# EAGLE design tweeq-BattCharger v1 (EAGLE 6.4)
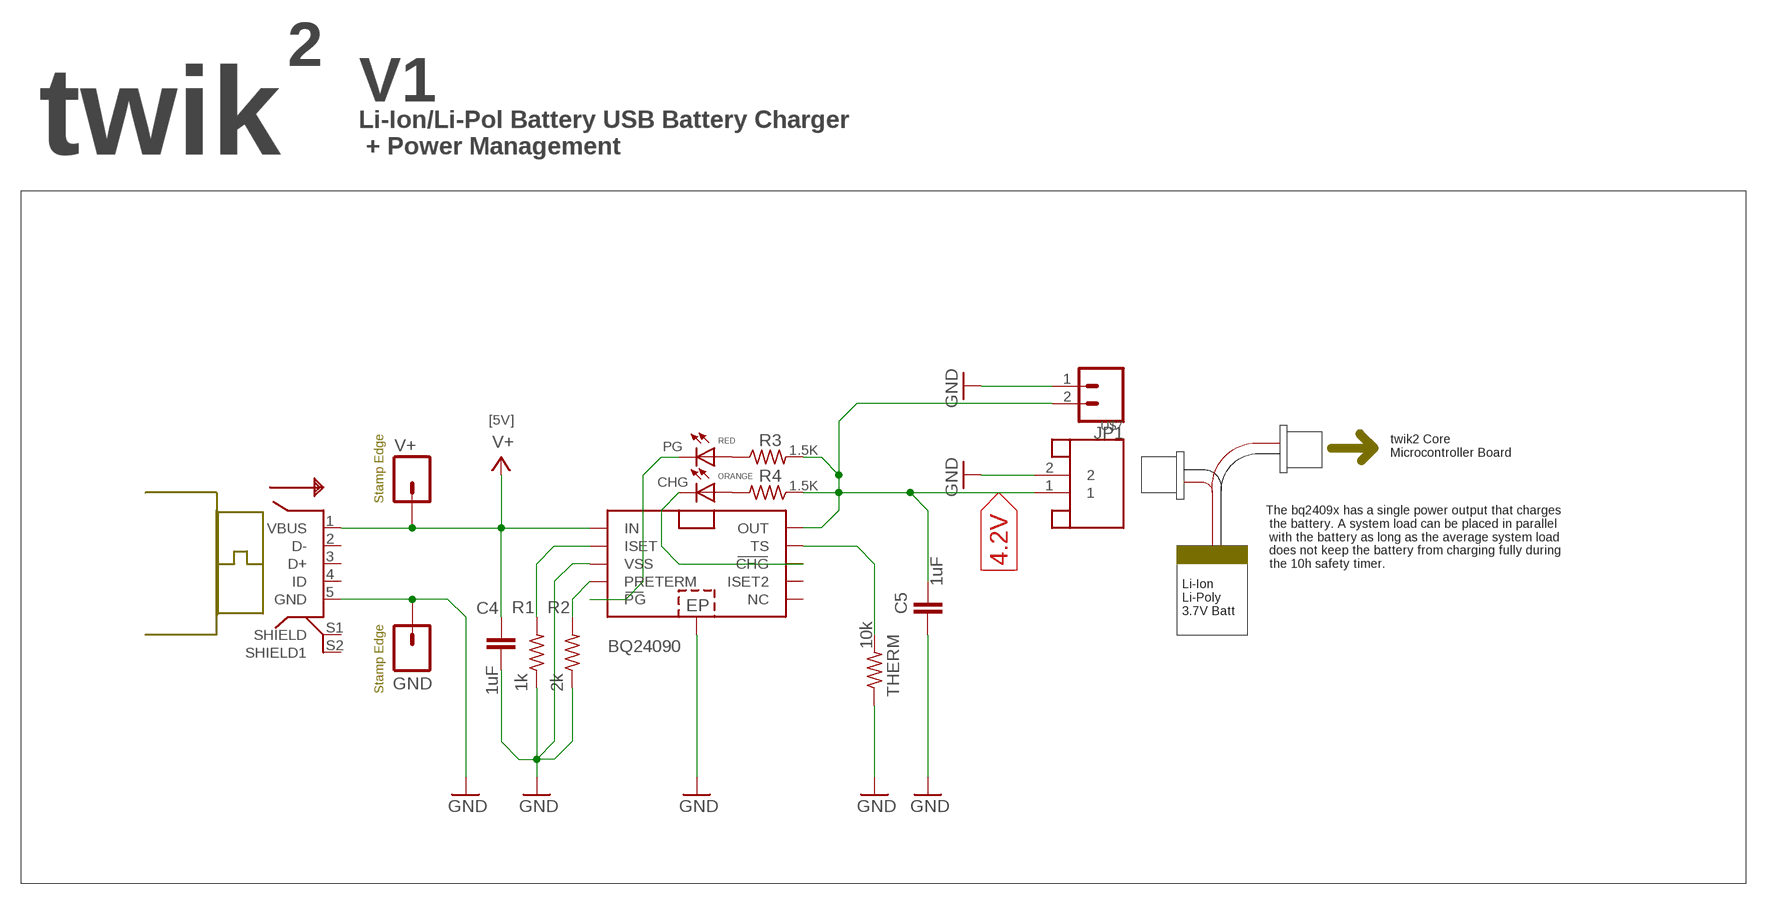
[diagram p0: schematic, sheet 1]

## Parts
BQ24090  BQ2409X-DGQ  [MSOP10_POWERPAD]
C4  1uF  C-EUC0603K  [C0603K]
C5  1uF  C-EUC0603K  [C0603K]
CHG  ORANGE  LEDCHIP-LED0603  [CHIP-LED0603]
GND  M01SQ_NS  [1X01_SQ]
JP1  M022.54-POL-TH  [1X02_2.54POL_TH]
PG  RED  LEDCHIP-LED0603  [CHIP-LED0603]
R1  1k  R-US_R0402  [R0402]
R2  2k  R-US_R0402  [R0402]
R3  1.5K  R-US_R0402  [R0402]
R4  1.5K  R-US_R0402  [R0402]
THERM  10k  R-US_R0402  [R0402]
U$2  USB/MICRO-5PF-B  [MICRO_USB_5PF_B]
U$7  JST-2PINSH  [SH1.0-2PIN]
V+  M01/R_NS  [1X01NS]

## Nets
4.2V: BQ24090.10(OUT) C5.2 JP1.2 R3.2 R4.1 U$7.1
GND: BQ24090.3(VSS) BQ24090.EP C4.2 C5.1 GND.1 JP1.1 R1.1 R2.1 THERM.1 U$2.5(GND) U$7.2
N$1: BQ24090.2(ISET) R1.2
N$2: BQ24090.5(PG) PG.C
N$3: BQ24090.4(PRETERM) R2.2
N$4: PG.A R3.1
N$6: BQ24090.9(TS) THERM.2
N$7: BQ24090.8(CHG) CHG.C
N$8: CHG.A R4.2
V+: BQ24090.1(IN) C4.1 U$2.1(VBUS) V+.1
Unconnected: BQ24090.6(NC) BQ24090.7(ISET2) U$2.2(D-) U$2.3(D+) U$2.4(ID) U$2.S1(SHIELD) U$2.S2(SHIELD1)

## Notes on the sheet
- 2
- V1
- twik
- Li-Ion/Li-Pol Battery USB Battery Charger
   + Power Management
- [5V]
- twik2 Core
  Microcontroller Board
- Stamp Edge
- The bq2409x has a single power output that charges
   the battery. A system load can be placed in parallel
   with the battery as long as the average system load
   does not keep the battery from charging fully during
   the 10h safety timer.
- Li-Ion
  Li-Poly
  3.7V Batt
- Stamp Edge

## Library data of the parts
BQ24090 = AISCube:BQ2409X: TI bq2409x Series 1A, Single-Input, Single Cell Li-Ion and Li-Pol Battery Charger
C4 C5 = AISCube:C-EU: CAPACITOR, European symbol
CHG PG = AISCube:LED: LED OSRAM: - CHIPLED LG R971, LG N971, LY N971, LG Q971, LY Q971, LO R971, LY R971 LH N974, LH R974 LS Q976, LO Q976, LY Q976 LO Q996 - Hyper CHIPLED LW Q18S LB Q993, LB Q99A, LB R99A - SideLED LS A670, LO A670, LY A670, LG A670, LP A670 LB A673, LV A673, LT A673, LW A673 LH A674 LY A675 LS A676, LA A676, LO A676, LY A676, LW A676 LS A679, LY A679, LG A679 - Hyper Micro SIDELED® LS Y876, LA Y876, LO Y876, LY Y876 LT Y87S - SmartLED LW L88C, LW L88S LB L89C, LB L89S, LG L890 LS L89K, LO L89K, LY L89K LS L896, LA L896, LO L896, LY L896 - TOPLED LS T670, LO T670, LY T670, LG T670, LP T670 LSG T670, LSP T670, LSY T670, LOP T670, LYG T670 LG T671, LOG T671, LSG T671 LB T673, LV T673, LT T673, LW T673 LH T674 LS T676, LA T676, LO T676, LY T676, LB T676, LH T676, LSB T676, LW T676 LB T67C, LV T67C, LT T67C, LS T67K, LO T67K, LY T67K, LW E67C LS E67B, LA E67B, LO E67B, LY E67B, LB E67C, LV E67C, LT E67C LW T67C LS T679, LY T679, LG T679 LS T770, LO T770, LY T770, LG T770, LP T770 LB T773, LV T773, LT T773, LW T773 LH T774 LS E675, LA E675, LY E675, LS T675 LS T776, LA T776, LO T776, LY T776, LB T776 LHGB T686 LT T68C, LB T68C - Hyper Mini TOPLED® LB M676 - Mini TOPLED Santana® LG M470 LS M47K, LO M47K, LY M47K Source: http://www.osram.convergy.de/
GND V+ = AISCube:M01: Header 1 Standard 1-pin 0.1" header.
JP1 = AISCube:M02: Header 2 Standard 2-pin 0.1" header. Use with straight break away headers (SKU : PRT-00116), right angle break away headers (PRT-00553), swiss pins (PRT-00743), machine pins (PRT-00117), and female headers (PRT-00115). Molex polarized connector foot print use with SKU : PRT-08233 with associated crimp pins and housings.
R1-R4 THERM = AISCube:R-US_: RESISTOR, American symbol
U$2 = AISCube:USB: USB 1.x/2.0 Mini/Micro Pinout Pin Name Cable color Description 1 VBUS Red +5 V 2 D− White Data − 3 D+ Green Data + 4 ID N/A Permits distinction of a host connection from device connection: • host: connected to the signal ground • device: not connected 5 GND Black Signal ground
U$7 = AISCube:JST-2PIN

## Board
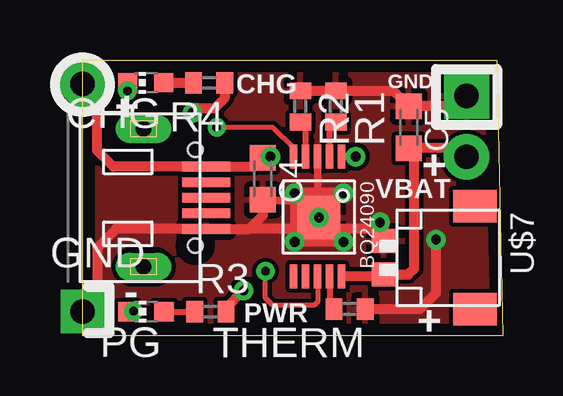
[diagram p1: board, top side]
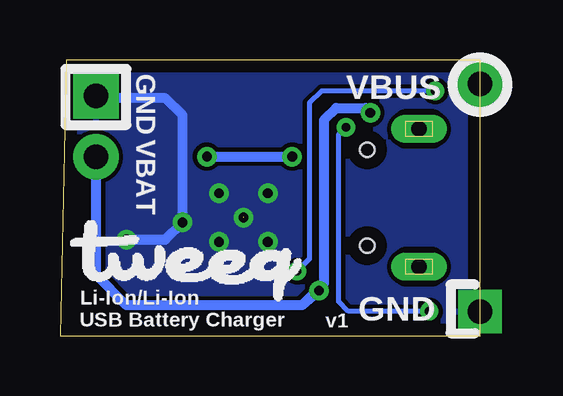
[diagram p2: board, bottom side, seen from below]

Size 17.5 x 11.5 mm. Coordinates in mm from the lower left corner, seen from the top.
Outline: 0,0 0,11.5 17.25,11.5 17.5,0 0,0
Copper layers (1*16): Top 0.0356mm / dielectric 1.5011mm / Bottom 0.0356mm
Design rules "AISCube": minimum track width 7mil, minimum drill 14mil, track to track 7mil, track to pad 7mil, pad to pad 7mil, via to via 7mil, smd to smd 0mil, copper to edge 20mil, drill to drill 8mil, minimum pad ring 10mil, minimum via ring 8mil, stop-mask expansion 4mil, vias tented up to drill 32mil, thermal gap 10mil

### Footprints (pad centres in the part's own frame; a part is rotated, then mirrored left to right if it is on the bottom)
MSOP10_POWERPAD = smd 1 x 0.3: 1 -2.55,0.95; 2 -2.55,0.45; 3 -2.55,-0.05; 4 -2.55,-0.55; 5 -2.55,-1.05; 6 2.45,-1.05; 7 2.45,-0.55; 8 2.45,-0.05; 9 2.45,0.45; 10 2.45,0.95 | smd 1.8 x 1.8: EP 0,0
C0603K = smd 1.05 x 1.08: 1 -0.875,0; 2 0.875,0
CHIP-LED0603 = smd 0.8 x 0.8: A 0,-0.75; C 0,0.75
1X01_SQ = drill 1.016 pad 1.8 square: 1 0,0
1X02_2.54POL_TH = drill 1.016 pad 1.88 square: 1 0,0 | drill 1.016 pad 1.88: 2 2.54,0
R0402 = smd 0.7 x 0.9: 1 -0.65,0; 2 0.65,0
MICRO_USB_5PF_B = smd 2 x 0.406: 1 -0.05,1.3; 2 -0.05,0.65; 3 -0.05,0; 4 -0.05,-0.65; 5 -0.05,-1.3 | drill 0.65 pad 1.05 long: S1 -2.65,2.875; S2 -2.65,-2.875 | hole 0.6: -0.5,2; -0.5,-2
SH1.0-2PIN = smd 1 x 1: 1 0.7,-0.55; 2 -0.7,-0.55 | smd 1.35 x 1.8: P$1 -2.15,3.25; P$2 2.15,3.25
1X01NS = drill 1.016 pad 1.88: 1 0,0

### Placement (x,y rotation side)
BQ24090  9.84,4.93 270 top
C4  7.51,6.54 270 top
C5  13.59,8.69 270 top
CHG  2.64,10.55 90 top
GND  0,1 0 top
JP1  16,10 270 top
PG  2.64,1 90 top
R1  10.55,9.56 270 top
R2  9.07,9.56 270 top
R3  5.33,1 0 top
R4  5.27,10.54 180 top
THERM  11.13,1.11 180 top
U$1  [TWEEQ-LOGO-M]  17.07,1.42 0 bottom
U$2  5.2,5.75 0 top
U$7  13.1,3.25 270 top
V+  0,10.5 0 top

### Tracks (layer width: path | path; a pad name or v marks a point on that pad's centre or on a via)
4.2V  (via drill 0.41)
  Top 0.305: BQ24090.10 11.06,2.48 10.97,2.48
  Top 0.406: JP1.2 15.64,7.82 C5.2 13.82,7.58 13.82,2.79 13.58,2.55 U$7.1 12.49,2.48 10.97,2.48 | R4.1 5.92,9.92 5.5,9.5 4.78,9.5 v4.57,9.29 | R3.2 5.97,1.15 v6.71,1.88
  Bottom 0.406: v6.71,1.88 7.42,1.27 | 7.42,1.27 14.73,1.27 16,2.53 JP1.2 | 7.42,1.27 6.5,2.18 6.5,8.99 5.99,9.5 4.78,9.5 v4.57,9.29
GND  (via drill 0.41)  (1 unrouted)
  Top 0.305: BQ24090.3 9.79,5.94 | 9.79,5.94 9.79,4.98 BQ24090.EP | 7.82,5.63 9.49,5.63 9.79,5.94
  Top 0.406: 6.94,4.45 U$2.5 1.4,4.45 0.61,3.66 0.61,1.61 GND.1 | 6.94,4.45 7.51,5.02 7.51,5.33 | 7.51,5.33 C4.2 | JP1.1 15.56,9.56 C5.1 12.94,10.21 R1.1 R2.1 | U$7.2 12.55,4.56 v12.39,4.72 12.12,4.45 6.94,4.45 | 7.51,5.33 7.82,5.63 | THERM.1 14.07,1.11 14.73,1.77 v14.73,4.01 | v10.87,5.94 v8.84,5.94 | v8.84,5.94 v8.84,3.91 v10.87,3.91 | v8.84,5.94 8.84,5.93 BQ24090.EP
  Bottom 0.406: JP1.1 15.9,9.9 13.11,9.9 12.39,9.19 v12.39,4.72 13.11,4.01 v14.73,4.01
  other vias: 9.86,4.92
  pour Bottom: 0.2,11.33 17.37,11.33 17.37,0.2 0.2,0.2
  pour Top: 0.2,11.33 17.37,11.33 17.37,0.2 0.2,0.2
N$1
  Top 0.254: BQ24090.2 10.29,8.65 R1.2
N$2  (via drill 0.36)
  Top 0.203: v2.12,1.02 1.91,1.02 PG.C | BQ24090.5 8.79,7.82 7.92,8.68 v5.59,8.68
  Bottom 0.203: v2.12,1.02 5.49,1.02 5.89,1.42 5.89,8.38 v5.59,8.68
N$3
  Top 0.254: BQ24090.4 9.29,8.69 R2.2
N$4
  Top 0.254: PG.A R3.1
N$6
  Top 0.254: BQ24090.9 10.29,1.3 THERM.2
N$7  (via drill 0.36)
  Top 0.203: BQ24090.8 9.79,1.41 9.65,1.27 7.92,1.27 7.62,1.57 v7.62,2.69
  Top 0.305: CHG.C 1.87,10.65 v1.87,10.21
  Bottom 0.203: v1.87,10.21 6.6,10.21 7.11,9.7 7.11,3.2 v7.62,2.69
N$8
  Top 0.406: R4.2 3.4,10.54 CHG.A
V+  (via drill 0.41)
  Top 0.305: BQ24090.1 10.96,7.48 v11.38,7.46
  Top 0.406: v7.82,7.46 C4.1 7.14,7.05 U$2.1 1.28,7.05 0.61,7.72 0.61,9.89 V+.1
  Bottom 0.406: v11.38,7.46 v7.82,7.46 7.62,7.46

### Text on the board
tPlace: CHG | GND | + | + | VBAT | - | PWR | +
bPlace: GND | VBUS | VBAT | GND | v1 | Li-Ion/Li-Ion / USB Battery Charger